# EAGLE design Domino Di (EAGLE 6.5.0)
Domino breakout Board
DATABASE: ./../Common/BOM/Domino_DB.txt; DRAWN: M.STEMPIN; REV: B
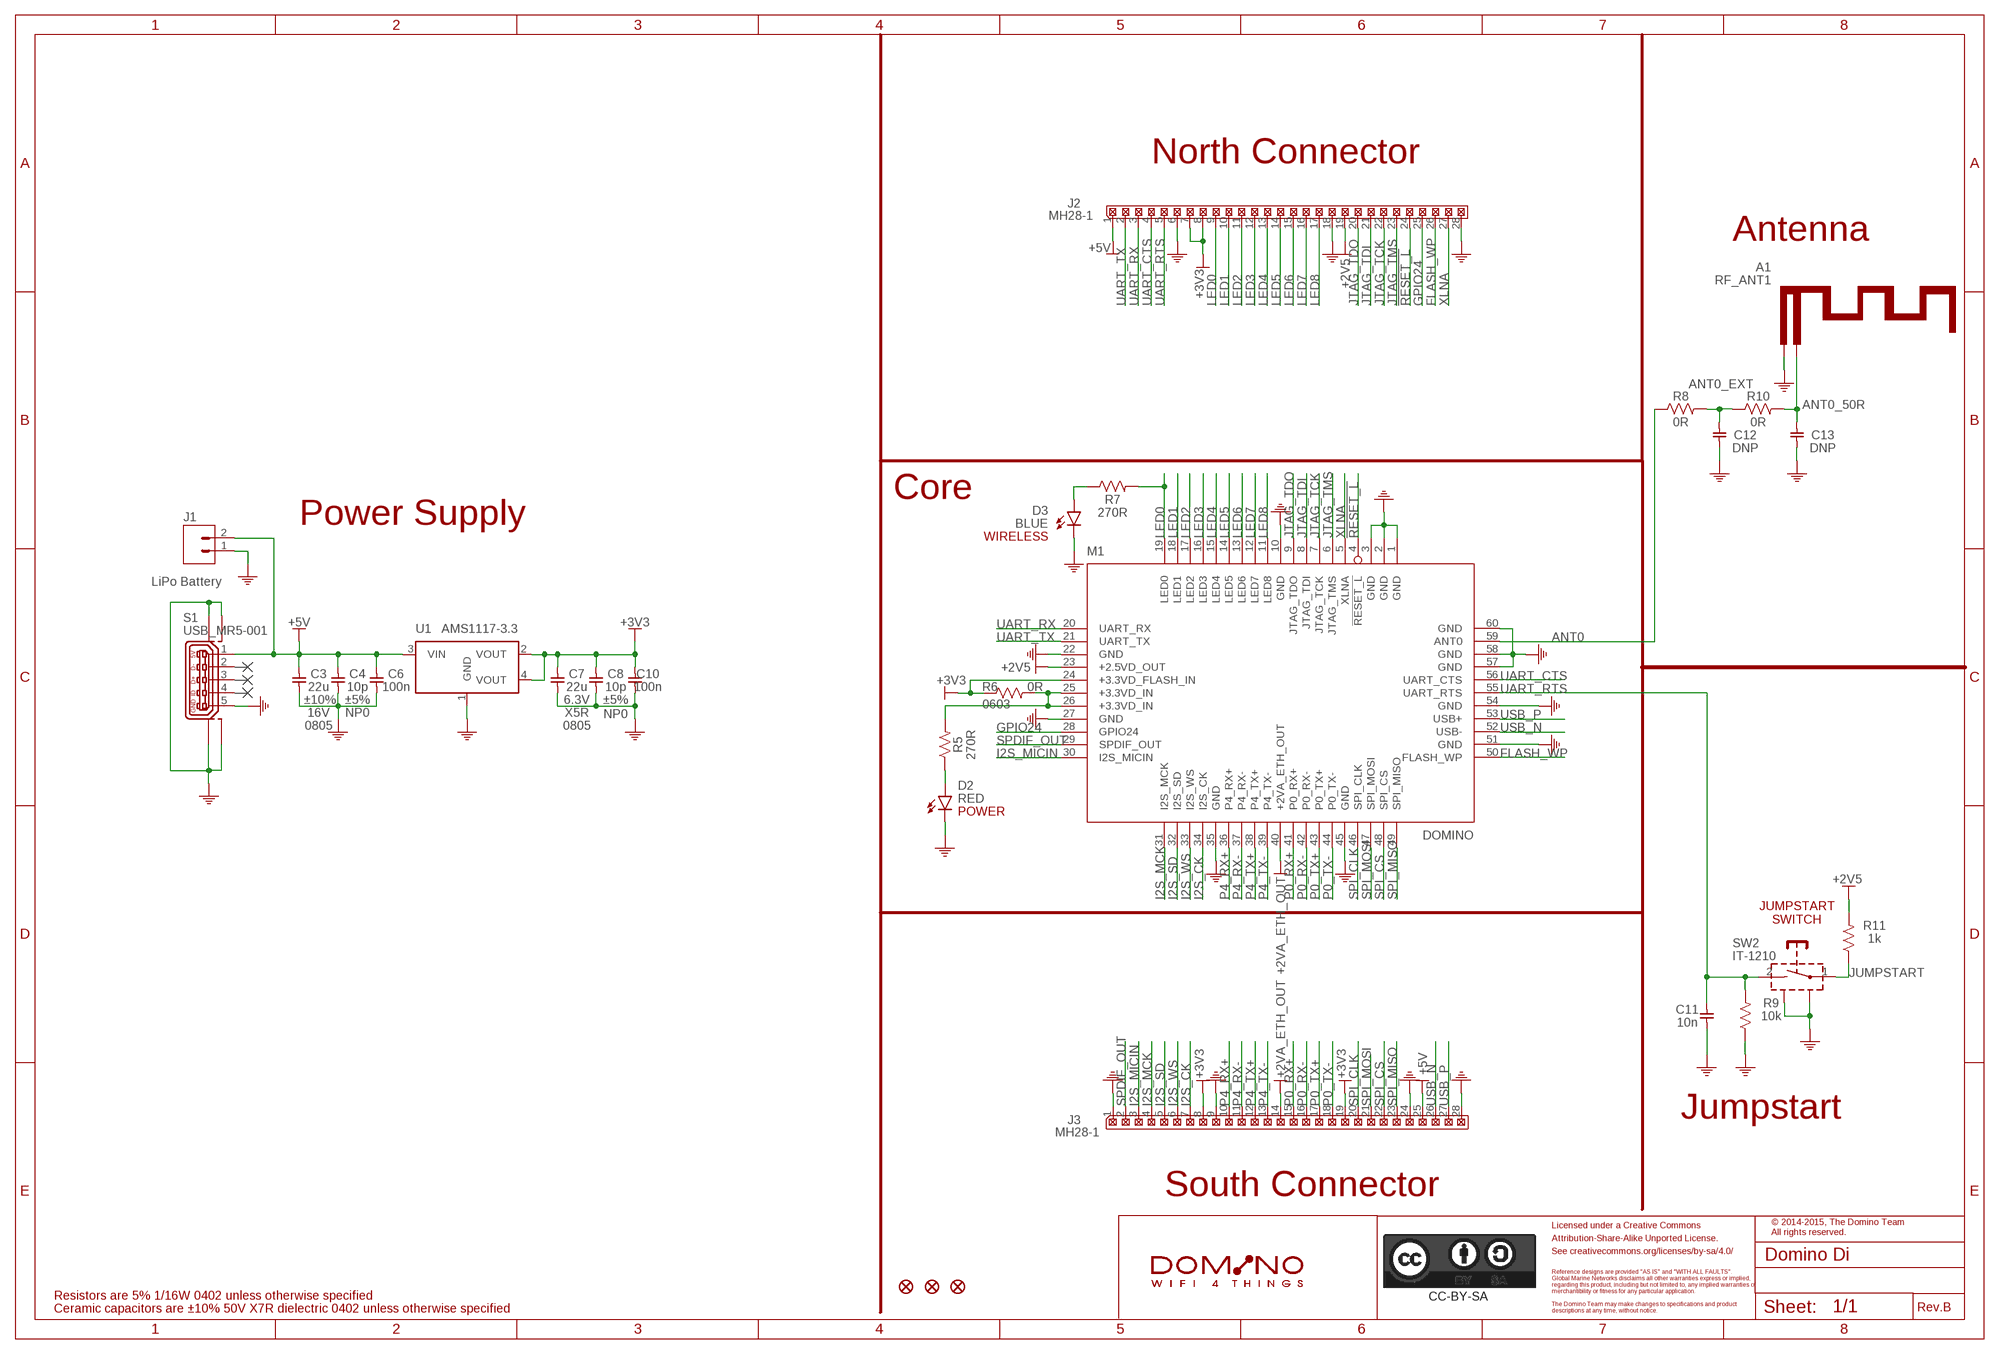
[diagram p0: schematic, sheet 1]
PORT1 (NC): BOM: EXCLUDE
PORT2 (NC): BOM: EXCLUDE
PORT3 (NC): BOM: EXCLUDE

## Parts
A1  RF_ANT1  [RF_ANT1]
C3  22u  CAP_0805  [C0805]
C4  10p  CAP_0402  [C0402]
C6  100n  CAP_0402  [C0402]
C7  22u  CAP_0805  [C0805]
C8  10p  CAP_0402  [C0402]
C10  100n  CAP_0402  [C0402]
C11  10n  CAP_0402  [C0402]
C12  DNP  CAP_0402  [C0402]
C13  DNP  CAP_0402  [C0402]
CC-BY-SA  CC-BY-SA_LOGO  [CC-BY-SA_LOGO]
D2  RED  LED_0402  [LED0402]
D3  BLUE  LED_0402  [LED0402]
F1  FIDUCIAL  [FIDUCIAL]
F2  FIDUCIAL  [FIDUCIAL]
F3  FIDUCIAL  [FIDUCIAL]
J1  LiPo Battery  S2B-PH-SM4-TB  [S2B-PH-SM4-TB]
J2  MH28-1  [MH28-1-0.1]
J3  MH28-1  [MH28-1-0.1]
M1  DOMINO  [DOMINO]
R5  270R  RES_0402  [R0402]
R6  0R  RES_0603  [R0603]
R7  270R  RES_0402  [R0402]
R8  0R  RES_0402  [R0402]
R9  10k  RES_0402  [R0402]
R10  0R  RES_0402  [R0402]
R11  1k  RES_0402  [R0402]
S1  USB_MR5-001  [USB-MR5-001]
SW2  IT-1210  [IT-1210]
U1  AMS1117-3.3  [SOT223]
W1  DOMINO_LOGO  [DOMINO_LOGO]

## Nets
!RESET_L: J2.24 M1.4(!RESET_L)
+2V5: J2.19 M1.23(+2.5VD_OUT) R11.2
+2VA_ETH_OUT [Ethernet]: J3.14 M1.40(+2VA_ETH_OUT)
+3.3VD_IN: M1.25(+3.3VD_IN) M1.26(+3.3VD_IN) R5.2 R6.2
+3V3: C7.1 C8.1 C10.1 J2.7 J2.8 J3.8 J3.19 M1.24(+3.3VD_FLASH_IN) R6.1 U1.2(VOUT) U1.4(VOUT)
+5V: C3.1 C4.1 C6.1 J1.2 J2.1 J3.25 S1.1 U1.3(VIN)
ANT0 [RF]: M1.59(ANT0) R8.1
ANT0_50R [RF]: A1.FEED C13.1 R10.2
ANT0_EXT [RF]: C12.1 R8.2 R10.1
BLUE_LED: D3.2(A) R7.1
FLASH_WP: J2.26 M1.50(FLASH_WP)
GND: A1.GND C3.2 C4.2 C6.2 C7.2 C8.2 C10.2 C11.2 C12.2 C13.2 D2.1(C) D3.1(C) J1.1 J2.6 J2.18 J2.28 J3.1 J3.9 J3.24 J3.28 M1.1(GND) M1.2(GND) M1.3(GND) M1.10(GND) M1.22(GND) M1.27(GND) M1.35(GND) M1.45(GND) M1.51(GND) M1.54(GND) M1.57(GND) M1.58(GND) M1.60(GND) R9.1 S1.5 S1.SH$1(M0) S1.SH$2(M1) S1.SH$3(M2) S1.SH$4(M3) SW2.SH$1 SW2.SH$2 U1.1(GND)
GPIO24: J2.25 M1.28(GPIO24)
I2S_CK: J3.7 M1.34(I2S_CK)
I2S_MCK: J3.4 M1.31(I2S_MCK)
I2S_MICIN: J3.3 M1.30(I2S_MICIN)
I2S_SD: J3.5 M1.32(I2S_SD)
I2S_WS: J3.6 M1.33(I2S_WS)
JTAG_TCK: J2.22 M1.7(JTAG_TCK)
JTAG_TDI: J2.21 M1.8(JTAG_TDI)
JTAG_TDO: J2.20 M1.9(JTAG_TDO)
JTAG_TMS: J2.23 M1.6(JTAG_TMS)
JUMPSTART: R11.1 SW2.1
LED0: J2.9 M1.19(LED0) R7.2
LED1: J2.10 M1.18(LED1)
LED2: J2.11 M1.17(LED2)
LED3: J2.12 M1.16(LED3)
LED4: J2.13 M1.15(LED4)
LED5: J2.14 M1.14(LED5)
LED6: J2.15 M1.13(LED6)
LED7: J2.16 M1.12(LED7)
LED8: J2.17 M1.11(LED8)
N$1: D2.2(A) R5.1
P0_RX+ [Ethernet]: J3.15 M1.41(P0_RX+)
P0_RX- [Ethernet]: J3.16 M1.42(P0_RX-)
P0_TX+ [Ethernet]: J3.17 M1.43(P0_TX+)
P0_TX- [Ethernet]: J3.18 M1.44(P0_TX-)
P4_RX+ [Ethernet]: J3.10 M1.36(P4_RX+)
P4_RX- [Ethernet]: J3.11 M1.37(P4_RX-)
P4_TX+ [Ethernet]: J3.12 M1.38(P4_TX+)
P4_TX- [Ethernet]: J3.13 M1.39(P4_TX-)
SPDIF_OUT: J3.2 M1.29(SPDIF_OUT)
SPI_CLK: J3.20 M1.46(SPI_CLK)
SPI_CS: J3.22 M1.48(SPI_CS)
SPI_MISO: J3.23 M1.49(SPI_MISO)
SPI_MOSI: J3.21 M1.47(SPI_MOSI)
UART_CTS: J2.4 M1.56(UART_CTS)
UART_RTS: C11.1 J2.5 M1.55(UART_RTS) R9.2 SW2.2
UART_RX: J2.3 M1.20(UART_RX)
UART_TX: J2.2 M1.21(UART_TX)
USB_N [USB]: J3.26 M1.52(USB-)
USB_P [USB]: J3.27 M1.53(USB+)
XLNA: J2.27 M1.5(XLNA)
Unconnected: S1.2 S1.3 S1.4

## Notes on the sheet
- North Connector
- Antenna
- Core
- Power Supply
- WIRELESS
- POWER
- JUMPSTART
  SWITCH
- Jumpstart
- South Connector
- Licensed under a Creative Commons
- © 2014-2015, The Domino Team
  All rights reserved.
- Attribution-Share-Alike Unported License.
- See creativecommons.org/licenses/by-sa/4.0/
- Reference designs are provided "AS IS" and "WITH ALL FAULTS".
- Global Marine Networks disclaims all other warranties express or implied,
- regarding this product, including but not limited to, any implied warranties of
- merchantibility or fitness for any particular application.
- Resistors are 5% 1/16W 0402 unless otherwise specified
- The Domino Team may make changes to specifications and product
- Ceramic capacitors are ±10% 50V X7R dielectric 0402 unless otherwise specified | descriptions at any time, without notice. | Rev.

## Library data of the parts
A1 = Domino:RF_ANT1: 2.4 GHz PCB WiFi Antenna; BOM: EXCLUDE; PARTNO: WIFI_ANT-2.4GHz
C3 = Domino:CAP_: Capacitor; PARTNO: C0805_22u_X5R_20%_CER_6V3; SIZE: 0805; TC: X5R; TOL: ±10%; TYPE: CER; VOLT: 16V
C4 C8 = Domino:CAP_: Capacitor; PARTNO: C0402_10p_NP0_5%_CER_50V; SIZE: 0402; TC: NP0; TOL: ±5%; TYPE: CER; VOLT: 50V
C6 C10 = Domino:CAP_: Capacitor; PARTNO: C0402_100n_X7R_10%_CER_50V; SIZE: 0402; TC: X7R; TOL: ±10%; TYPE: CER; VOLT: 50V
C7 = Domino:CAP_: Capacitor; PARTNO: C0805_22u_X5R_20%_CER_6V3; SIZE: 0805; TC: X5R; TOL: ±20%; TYPE: CER; VOLT: 6.3V
C11 = Domino:CAP_: Capacitor; PARTNO: C0402_10n_X7R_10%_CER_50V; SIZE: 0402; TC: X7R; TOL: ±10%; TYPE: CER; VOLT: 50V
C12 C13 = Domino:CAP_: Capacitor; DNP: T; PARTNO: C0402_DNP; SIZE: 0402
CC-BY-SA = Domino:CC-BY-SA_LOGO: Attribution-Share-Alike Unported License See creativecommons.org/licenses/by-sa/3.0/ for details.; BOM: EXCLUDE
D2 = Domino:LED_: LED; PARTNO: LED0402-RED
D3 = Domino:LED_: LED; PARTNO: LED0402-BLUE
F1-F3 = Domino:FIDUCIAL: Fiducial Mark; BOM: EXCLUDE
J1 = Domino:S*B-PH-?-TB: JST PH Connector 2.0mm pithc/Disconnectable Crimp style connectors; PARTNO: S2B-PH-SM4-TB
J2 J3 = Domino:MH28-1: 28x1 Pin Male Header; PARTNO: MH28-1-0.1
M1 = Domino:DOMINO: GL-Connect Domino WiFi Module; PARTNO: DOMINO-CORE
R5 R7 = Domino:RES_: Resistor; PARTNO: R0402_270R_5%_62.5mW; RATE: 62.5mW; SIZE: 0402; TOL: 5%
R6 = Domino:RES_: Resistor; PARTNO: R0603_0R_5%_125mW; RATE: 125mW; SIZE: 0603; TOL: 5%
R8 R10 = Domino:RES_: Resistor; PARTNO: R0402_0R_5%_62.5mW; RATE: 62.5mW; SIZE: 0402; TOL: 5%
R9 = Domino:RES_: Resistor; PARTNO: R0402_10k_5%_62.5mW; RATE: 62.5mW; SIZE: 0402; TOL: 5%
R11 = Domino:RES_: Resistor; PARTNO: R0402_1k_5%_62.5mW; RATE: 62.5mW; SIZE: 0402; TOL: 5%
S1 = Domino:USB_MR5-001: Micro USB Type B Receptacle, 4 Shield Pins SMT; PARTNO: USB MR5-001
SW2 = Domino:IT-1210: Tact Switch SPST, 2 Contacts, 2 Shield Pins; PARTNO: IT-1210
U1 = Domino:AMS1117-: 1-A, Positive Fixed Voltage, Low-Dropout Regulator; PARTNO: AMS1117-3.3
W1 = Domino:DOMINO_LOGO: Domino Logo; BOM: EXCLUDE

## Net classes
1 USB: width 0.368 mm, clearance 0.152 mm to class 0, clearance 0.152 mm
2 RF: width 0.66 mm, clearance 0.152 mm
3 Ethernet: width 0.254 mm, clearance 0.152 mm to class 0, clearance 0.152 mm to class 1, clearance 0.152 mm to class 2, clearance 0.152 mm

## Board
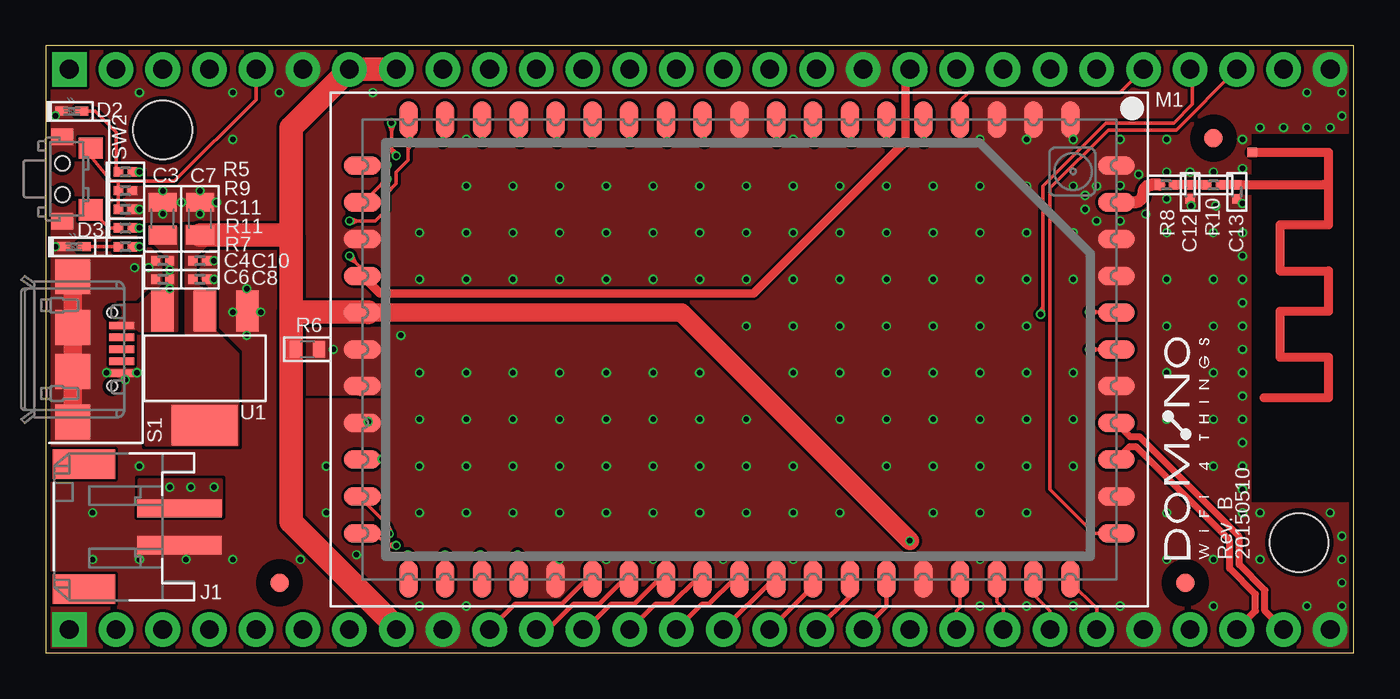
[diagram p1: board, top side]
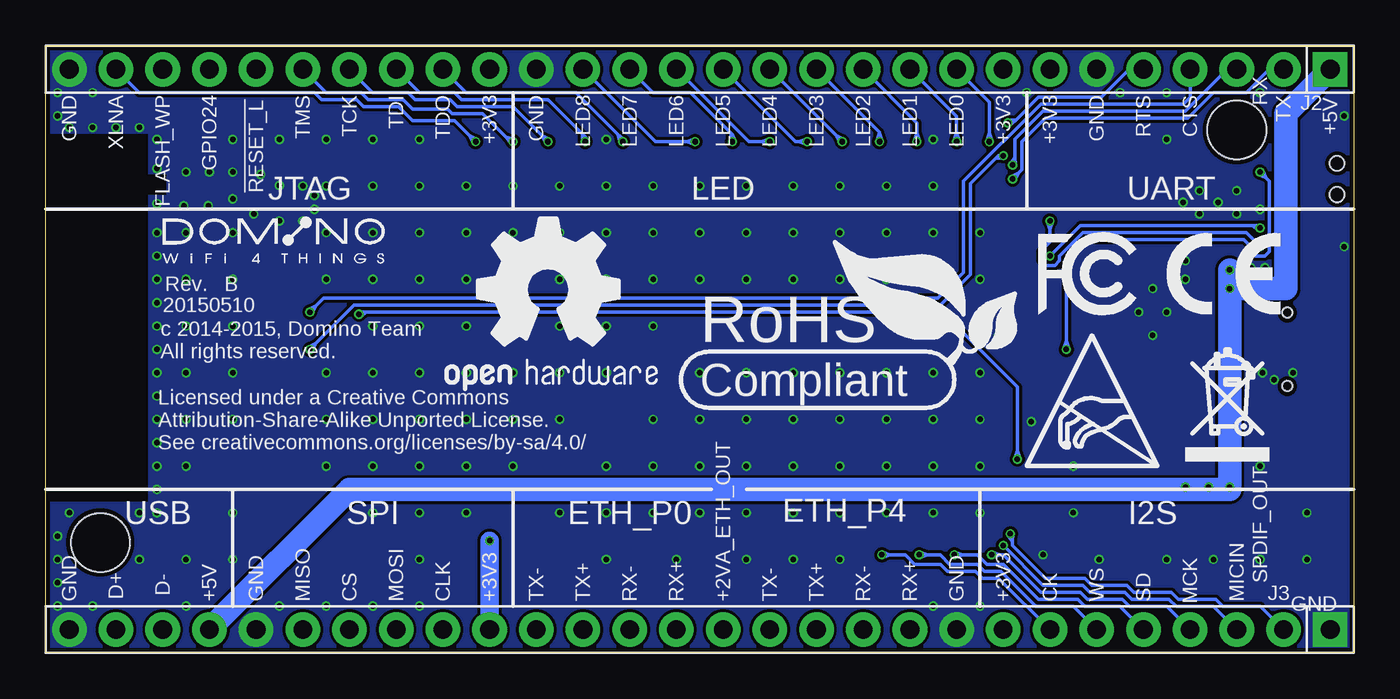
[diagram p2: board, bottom side, seen from below]

Size 71.12 x 33.02 mm. Coordinates in mm from the lower left corner, seen from the top.
Outline: 0,0 71.12,0 71.12,33.02 0,33.02 0,0
Copper layers (1*16): Top 0.043mm / dielectric 1mm / Bottom 0.043mm
Design rules "Domino *": minimum track width 0.1mm, minimum drill 0.3mm, track to track 6mil, track to pad 6mil, pad to pad 6mil, via to via 6mil, smd to smd 0mil, copper to edge 0.25mm, drill to drill 0.35mm, minimum pad ring 0.085mm, minimum via ring 0.1mm, stop-mask expansion 0mil, vias tented up to drill 0.45mm, thermal gap 0.2mm
Holes 3.2 mm at 68.16,6 6.35,28.45

### Footprints (pad centres in the part's own frame; a part is rotated, then mirrored left to right if it is on the bottom)
RF_ANT1 = smd 0.5 x 0.5: FEED 1.75,-0.44; GND 0,0.5
C0805 = smd 1.016 x 1.524: 1 -0.889,0; 2 0.889,0
C0402 = smd 0.508 x 0.508: 1 -0.381,0; 2 0.381,0
LED0402 = smd 0.7 x 0.5: 1 -0.55,0; 2 0.55,0
FIDUCIAL = smd 1.016 x 1.016: 1 0,0
S2B-PH-SM4-TB = smd 1 x 4.6: 1 -1,-3.7; 2 1,-3.7 | smd 1.6 x 3.4: NC1 -3.4,1.5; NC2 3.4,1.5
MH28-1-0.1 = drill 1.016 pad 1.88 square: 1 0,0 | drill 1.016 pad 1.88: 2 2.54,0; 3 5.08,0; 4 7.62,0; 5 10.16,0; 6 12.7,0; 7 15.24,0; 8 17.78,0; 9 20.32,0; 10 22.86,0; 11 25.4,0; 12 27.94,0; 13 30.48,0; 14 33.02,0; 15 35.56,0; 16 38.1,0; 17 40.64,0; 18 43.18,0; 19 45.72,0; 20 48.26,0; 21 50.8,0; 22 53.34,0; 23 55.88,0; 24 58.42,0; 25 60.96,0; 26 63.5,0; 27 66.04,0; 28 68.58,0
DOMINO = smd 2 x 1: 1 -12.5,18; 2 -12.5,16; 3 -12.5,14; 4 -12.5,12; 5 -12.5,10; 6 -12.5,8; 7 -12.5,6; 8 -12.5,4; 9 -12.5,2; 10 -12.5,0; 11 -12.5,-2; 12 -12.5,-4; 13 -12.5,-6; 14 -12.5,-8; 15 -12.5,-10; 16 -12.5,-12; 17 -12.5,-14; 18 -12.5,-16; 19 -12.5,-18; 31 12.5,-18; 32 12.5,-16; 33 12.5,-14; 34 12.5,-12; 35 12.5,-10; 36 12.5,-8; 37 12.5,-6; 38 12.5,-4; 39 12.5,-2; 40 12.5,0; 41 12.5,2; 42 12.5,4; 43 12.5,6; 44 12.5,8; 45 12.5,10; 46 12.5,12; 47 12.5,14; 48 12.5,16; 49 12.5,18 | smd 1 x 2: 20 -10,-20.5; 21 -8,-20.5; 22 -6,-20.5; 23 -4,-20.5; 24 -2,-20.5; 25 0,-20.5; 26 2,-20.5; 27 4,-20.5; 28 6,-20.5; 29 8,-20.5; 30 10,-20.5; 50 10,20.5; 51 8,20.5; 52 6,20.5; 53 4,20.5; 54 2,20.5; 55 0,20.5; 56 -2,20.5; 57 -4,20.5; 58 -6,20.5; 59 -8,20.5; 60 -10,20.5
R0402 = smd 0.508 x 0.508: 1 -0.381,0; 2 0.381,0
R0603 = smd 0.635 x 0.889: 1 -0.635,0; 2 0.635,0
USB-MR5-001 = smd 0.4 x 1.35: 1 -1.3,2.675; 2 -0.65,2.675; 3 0,2.675; 4 0.65,2.675; 5 1.3,2.675 | smd 1.9 x 1.9: SH$1 -3.95,0; SH$2 -1.2,0; SH$3 1.2,0; SH$4 3.95,0 | hole 0.55: -2,2.15; 2,2.15
IT-1210 = smd 1.15 x 1.3: 1 -1.675,-1.55; 2 1.675,-1.55 | smd 0.9 x 1.2: SH$1 -2.3,0; SH$2 2.3,0 | hole 0.8: -0.85,0; 0.85,0
SOT223 = smd 1.219 x 2.235: 1 -2.311,-3.099; 2 0,-3.099; 3 2.311,-3.099 | smd 3.6 x 2.2: 4 0,3.099

### Placement (x,y rotation side)
A1  65.1,27.23 270 top
C3  6.35,23.62 90 top
C4  6.35,21.34 180 top
C6  6.35,20.32 180 top
C7  8.38,23.62 90 top
C8  8.38,20.32 0 top
C10  8.38,21.34 0 top
C11  4.32,24.13 0 top
C12  62.23,25.08 270 top
C13  64.77,25.08 270 top
CC-BY-SA  10.16,-49.53 0 top  (outside the outline)
D2  1.4,29.46 0 top
D3  1.52,22.1 0 top
DRILEGEND  [DRILEGEND]  96.77,61.21 0 top  (outside the outline)
F1  12.7,3.81 0 top
F2  61.98,3.81 0 top
F3  63.5,28 0 top
J1  3.56,6.86 90 top
J2  1.27,31.75 180 bottom
J3  1.27,1.27 180 bottom
M1  37.72,16.51 270 top
R5  4.32,26.16 0 top
R6  14.22,16.51 0 top
R7  4.32,22.1 0 top
R8  60.96,25.46 0 top
R9  4.32,25.15 180 top
R10  63.5,25.46 0 top
R11  4.32,23.11 0 top
S1  1.45,16.51 270 top
SW2  0.89,25.78 90 top
U1  8.64,15.49 180 top
U$6  [DOMINO_LOGO_SMALL]  62.23,5.08 90 top
U$8  [DOMINO_LOGO_SMALL]  64.77,22.23 0 bottom
U$28  [A5L-LOC]  -40.64,-60.96 0 top  (outside the outline)
U$36  [ESD_LOGO]  17.78,10.16 0 bottom
U$38  [OPEN_HARDWARE_LOGO]  43.81,19.68 0 bottom
U$39  [RECYCLE_BIN_LOGO]  9.14,10.41 0 bottom
U$40  [ROHS_LOGO]  35.56,13.97 0 bottom
U$41  [CE_LOGO_SMALL]  10.16,18.41 0 bottom
U$42  [FCC_LOGO_SMALL]  17.14,18.41 0 bottom
W1  -33.02,-46.99 0 top  (outside the outline)

### Tracks (layer width: path | path; a pad name or v marks a point on that pad's centre or on a via)
!RESET_L
  Top 0.203: M1.4 49.72,30.03 50.16,30.48 58.42,30.48 J2.24
+2V5  (via drill 0.3)
  Top 0.203: M1.23 17.22,20.88 16.83,21.27 | 16.83,21.27 v16.51,21.59 | v5.08,23.11 R11.2 | 16.83,21.27 16.64,21.65 v16.51,21.59 | 16.83,21.27 16.45,21.46 v16.51,21.59
  Top 0.457: J2.19 46.74,31.5 46.74,27.81 38.48,19.56 18.17,19.56 M1.23
  Bottom 0.203: v5.08,23.11 5.21,23.24 5.51,23.24 | 5.51,23.24 14.86,23.24 v16.51,21.59 | 5.51,23.24 5.09,23.26 v5.08,23.11 | 5.51,23.24 5.17,22.99 v5.08,23.11
+2VA_ETH_OUT
  Top 0.254: M1.40 37.41,4.01 36.07,2.67 35.69,2.67 J3.14
+3.3VD_IN  (via drill 0.3)
  Top 0.203: R5.2 v5.08,26.16
  Top 1.016: M1.26 arc-45 17.14,14.48
  Bottom 0.203: 4.76,25.84 4.57,25.65 4.57,21.84 4.83,21.59 5.33,21.59 5.59,21.84 5.59,22.1 5.97,22.48 14.61,22.48 15.62,21.46 15.62,16.96 | 4.76,25.84 v5.08,26.16 | 15.62,16.96 v15.62,16.51 | 15.62,16.96 15.48,16.56 v15.62,16.51 | 15.62,16.96 15.76,16.56 v15.62,16.51 | 4.76,25.84 5.14,26.03 v5.08,26.16 | 4.76,25.84 4.95,26.23 v5.08,26.16
  pour Top (no thermals): 13.97,17.65 18.16,17.65 18.16,14.1 13.97,14.1
+3V3  (via drill 0.3 pad 0.03)
  Top 0.203: R6.1 13.34,16.51 13.34,18.29
  Top 1.016: M1.24 17.53,18.51 34.58,18.51 v46.99,6.1 | M1.24 | 16.51,31.62 J2.7 | M1.24 16.77,18.51
  Top 1.27: J2.8 J2.7 13.34,28.57 13.34,22.73 | J3.8 19.05,1.52 18.92,1.52 13.34,7.11 13.34,18.29 13.34,18.54 | C7.1 13.34,22.73 | 13.34,18.54 17.53,18.54 17.53,18.51 | 13.34,22.73 13.34,18.54
  Bottom 1.016: J3.19 v46.99,6.1
  pour Top (no thermals): 7.62,23.24 9.02,23.11 9.02,22.35 8.89,22.35 8.13,21.59 8.13,20.19 8.76,19.56 9.14,19.56 9.14,17.53 10.41,16.26 10.41,11.3 5.46,11.3 5.46,17.14 7.62,17.14
+5V  (via drill 0.3)
  Bottom 1.27: J2.1 3.68,29.34 3.68,19.81 v6.73,19.81 | J3.25 54.61,8.89 6.73,8.89 v6.73,9.02 v6.73,19.81 | v6.73,19.81 v6.73,20.83
  other vias: 9.14,9.02 7.87,9.02
  pour Top (no thermals): 5.71,23.11 7.11,23.11 7.11,17.53 5.08,17.53 4.95,17.65 3.56,17.65 3.56,18.92 5.08,18.92 5.71,19.56 6.22,19.56 6.6,19.94 6.6,21.59 5.84,22.35 5.71,22.35
  pour Top (no thermals): 5.08,7.49 9.53,7.49 9.53,9.4 5.08,9.4 5.08,7.62
ANT0
  Top 0.66: 57.78,24.51 M1.59 59.18,24.51 arc90 59.69,25.02 arc-90 60.13,25.46 R8.1
ANT0_50R
  Top 0.508: R10.2 C13.1 64.64,25.46 A1.FEED
ANT0_EXT
  Top 0.508: R8.2 C12.1 R10.1
BLUE_LED
  Top 0.203: D3.2 R7.1
FLASH_WP
  Top 0.203: M1.50 56.99,6.51 54.61,8.89 54.61,25.27 57.78,28.45 61.47,28.45 J2.26
GND  (via drill 0.3, 0.3 pad 0.03)
  Top 1.016: S1.SH$3 S1.SH$1 1.56,20.57 | S1.SH$3 S1.SH$2 | S1.SH$3 S1.SH$4
  other vias: 25.4,25.4 27.94,25.4 30.48,25.4 45.72,25.4 57.15,25.4 59.44,26.04 60.96,24.7 63.5,22.86 50.8,22.86 45.72,22.86 27.94,20.32 30.48,20.32 33.02,20.32 35.56,20.32 38.1,20.32 40.64,20.32 45.72,20.32 50.8,20.32 22.86,15.24 20.32,12.7 27.94,15.24 30.48,15.24 33.02,15.24 35.56,15.24 43.18,15.24 45.72,15.24 50.8,15.24 60.96,12.7 50.8,12.7 45.72,12.7 38.1,12.7 35.56,12.7 33.02,12.7 27.94,12.7 25.4,12.7 27.94,10.16 30.48,10.16 33.02,10.16 35.56,10.16 38.1,10.16 40.64,10.16 63.5,10.16 55.88,2.54 57.15,23.5 56.52,24.13 56.52,24.89 58.42,25.43 58.42,23.5 60.96,26.16 59.82,23.88 62.23,26.16 38.1,22.86 33.02,22.86 30.48,22.86 27.94,22.86 25.4,22.86 43.18,20.32 25.4,10.16 22.86,20.32 63.5,5.08 58.42,2.54 22.86,10.16 22.86,25.4 33.02,25.4 35.56,22.86 35.56,25.4 38.1,25.4 40.64,25.4 40.64,22.86 43.18,22.86 27.94,5.08 68.58,30.48 60.96,27.94 58.42,27.94 53.34,27.94 50.8,27.94 50.8,25.4 53.34,25.4 53.34,22.86 53.34,20.32 53.34,15.24 53.34,12.7 53.34,10.16 50.8,10.16 45.72,10.16 43.18,12.7 40.64,15.24 60.96,7.62 60.96,5.08 63.5,2.54 30.48,12.7 17.78,30.48 20.32,20.32 20.32,15.24 43.18,25.4 40.64,27.94 22.86,27.94 55.88,22.86 55.88,20.32 55.88,15.24 55.88,12.7 55.88,10.16 55.88,25.4 68.58,2.54 30.48,5.08 33.02,5.08 36.83,5.08 40.64,5.08 50.8,5.08 53.34,2.54 50.8,2.54 48.26,25.4 48.26,22.86 48.26,20.32 48.26,15.24 48.26,12.7 48.26,10.16 20.32,22.86 20.32,2.54 22.86,2.54 55.88,27.94 66.04,5.08 0.51,29.21 0.51,22.1 12.7,30.48 10.16,30.48 63.5,12.7 63.5,15.24 60.96,15.24 60.96,17.78 63.5,17.78 63.5,20.32 60.96,20.32 60.96,22.86 62.29,24.32 63.63,24.32 65.09,24.45 63.5,26.16 65.09,26.35 65.09,20.32 65.09,21.59 65.09,22.86 65.09,19.05 65.09,17.78 65.09,16.51 65.09,15.24 65.09,13.97 65.09,12.7 65.09,11.43 65.09,10.16 65.09,8.89 65.09,7.62 66.04,7.62 69.85,7.62 70.48,6.35 70.48,5.08 70.48,3.81 70.48,2.54 65.09,27.94 66.04,28.57 67.31,28.57 68.58,28.57 69.85,28.57 70.48,29.21 70.48,30.48 25.4,15.24 22.86,12.7 20.32,10.16 40.64,17.78 43.18,17.78 45.72,17.78 48.26,17.78 50.8,17.78 53.34,17.78 38.1,17.78 20.32,7.62 22.86,7.62 25.4,7.62 27.94,7.62 30.48,7.62 33.02,7.62 35.56,7.62 38.1,7.62 40.64,7.62 43.18,7.62 48.26,7.62 50.8,7.62 53.34,7.62 25.4,20.32 22.86,22.86 13.84,5.08 16.89,5.33 17.53,12.57 19.3,17.27 4.95,15.24 4.32,14.86 2.54,7.62 2.54,5.08 5.08,5.08 7.62,5.08 10.16,5.08 15.24,7.62 5.08,24.13 10.16,27.94 15.24,10.16 5.08,30.48 5.08,10.16 6.35,25.15 8.38,25.15 9.27,24.51 7.37,24.51 6.35,23.88 8.38,23.88 9.14,21.34 9.14,20.32 10.92,19.81 11.68,18.54 10.16,18.54 10.92,17.27 3.3,15.24 5.59,20.95 4.83,20.95
  pour Top (rank 3, no thermals): 0,33 71.62,33 71.62,0 0,0 0,12.7 0,20.32
  pour Bottom (no thermals): 0,33 71.62,33 71.62,0 0,0 0,12.7 0,20.32
GPIO24  (via drill 0.3 pad 0.03)
  Top 0.203: v18.29,10.54 17.84,10.54 | 17.84,10.54 17.25,10.54 M1.28 | J2.25 62.36,31.62 62.36,29.84 61.34,28.83 57.66,28.83 54.23,25.4 54.23,18.85 | 54.23,18.85 54.23,18.54 v54.1,18.41 | 17.84,10.54 18.24,10.4 v18.29,10.54 | 17.84,10.54 18.24,10.68 v18.29,10.54 | 54.23,18.85 53.98,18.5 v54.1,18.41 | 54.23,18.85 54.25,18.42 v54.1,18.41
  Bottom 0.203: 53.67,18.54 22.35,18.54 18.29,14.48 18.29,10.99 | 53.67,18.54 53.98,18.54 v54.1,18.41 | v18.29,10.54 18.29,10.99 | 18.29,10.99 18.15,10.59 v18.29,10.54 | 18.29,10.99 18.43,10.59 v18.29,10.54 | 53.67,18.54 54.02,18.29 v54.1,18.41 | 53.67,18.54 54.09,18.56 v54.1,18.41
I2S_CK  (via drill 0.3 pad 0.03)
  Top 0.254: M1.34 25.72,4.89 | 25.72,4.89 25.72,5.27 v25.65,5.33 | 25.72,4.89 25.78,5.32 v25.65,5.33 | 25.72,4.89 25.54,5.28 v25.65,5.33
  Bottom 0.203: v25.65,5.33 25.2,5.33 | 25.2,5.33 24.38,5.33 23.88,4.83 22.48,4.83 22.1,4.45 20.57,4.45 20.19,4.06 19.3,4.06 J3.7 | 25.2,5.33 25.61,5.19 v25.65,5.33 | 25.2,5.33 25.61,5.47 v25.65,5.33
I2S_MCK  (via drill 0.3 pad 0.03)
  Top 0.254: M1.31 19.72,4.88 | 19.72,4.88 19.72,5.3 v19.68,5.33 | 19.72,4.88 19.81,5.31 v19.68,5.33 | 19.72,4.88 19.57,5.29 v19.68,5.33
  Bottom 0.203: v19.68,5.33 19.23,5.33 | 19.23,5.33 19.05,5.33 17.02,3.3 14.86,3.3 14.48,2.92 12.57,2.92 12.19,2.54 10.16,2.54 J3.4 | 19.23,5.33 19.64,5.19 v19.68,5.33 | 19.23,5.33 19.64,5.47 v19.68,5.33
I2S_MICIN  (via drill 0.3 pad 0.03)
  Top 0.203: M1.30 17.87,6.51 18.54,5.84 18.6,5.84 | 18.6,5.84 v19.05,5.84 | 18.6,5.84 19,5.7 v19.05,5.84 | 18.6,5.84 19,5.98 v19.05,5.84
  Bottom 0.203: v19.05,5.84 16.89,3.68 14.73,3.68 14.35,3.3 12.45,3.3 12.06,2.92 10.03,2.92 9.65,2.54 7.62,2.54 J3.3
I2S_SD  (via drill 0.3 pad 0.03)
  Top 0.254: M1.32 21.72,4.88 | 21.72,4.88 v21.72,5.33 | 21.72,4.88 21.84,5.3 v21.72,5.33 | 21.72,4.88 21.6,5.3 v21.72,5.33
  Bottom 0.203: v21.72,5.33 21.27,5.33 | 21.27,5.33 20.45,5.33 19.94,4.83 19.05,4.83 17.14,2.92 14.99,2.92 14.61,2.54 12.7,2.54 J3.5 | 21.27,5.33 21.67,5.19 v21.72,5.33 | 21.27,5.33 21.67,5.47 v21.72,5.33
I2S_WS  (via drill 0.3 pad 0.03)
  Top 0.254: M1.33 23.72,4.89 | 23.72,4.89 23.72,5.24 v23.62,5.33 | 23.72,4.89 23.75,5.33 v23.62,5.33 | 23.72,4.89 23.51,5.28 v23.62,5.33
  Bottom 0.203: v23.62,5.33 23.17,5.33 | 23.17,5.33 22.48,5.33 21.97,4.83 20.45,4.83 20.07,4.45 19.18,4.45 17.27,2.54 15.24,2.54 J3.6 | 23.17,5.33 23.57,5.19 v23.62,5.33 | 23.17,5.33 23.57,5.47 v23.62,5.33
JTAG_TCK  (via drill 0.3 pad 0.03)
  Top 0.203: M1.7 43.72,28.25 | 43.72,28.25 43.72,27.91 v43.81,27.81 | 43.72,28.25 43.67,27.83 v43.81,27.81 | 43.72,28.25 43.94,27.89 v43.81,27.81
  Bottom 0.203: v43.81,27.81 44.13,28.13 | 44.13,28.13 45.72,29.72 48.77,29.72 49.15,30.1 51.05,30.1 51.44,30.48 53.34,30.48 J2.22 | 44.13,28.13 43.75,27.95 v43.81,27.81 | 44.13,28.13 43.95,27.75 v43.81,27.81
JTAG_TDI  (via drill 0.3 pad 0.03)
  Top 0.203: M1.8 41.72,28.26 | 41.72,28.26 41.72,27.88 v41.78,27.81 | 41.72,28.26 41.64,27.84 v41.78,27.81 | 41.72,28.26 41.91,27.88 v41.78,27.81
  Bottom 0.203: v41.78,27.81 41.78,28.07 41.95,28.23 | 41.95,28.23 43.81,30.1 48.51,30.1 48.9,30.48 50.8,30.48 J2.21 | 41.95,28.23 41.67,27.91 v41.78,27.81 | 41.95,28.23 41.93,27.81 v41.78,27.81
JTAG_TDO  (via drill 0.3 pad 0.03)
  Top 0.203: M1.9 39.72,28.26 | 39.72,28.26 39.72,27.84 v39.75,27.81 | 39.72,28.26 39.61,27.85 v39.75,27.81 | 39.72,28.26 39.89,27.87 v39.75,27.81
  Bottom 0.203: J2.20 48.26,30.48 42.29,30.48 40,28.19 | v39.75,27.81 39.75,27.94 40,28.19 | 40,28.19 39.66,27.93 v39.75,27.81 | 40,28.19 39.9,27.78 v39.75,27.81
JTAG_TMS  (via drill 0.3 pad 0.03)
  Top 0.203: M1.6 45.72,28.26 | 45.72,28.26 v45.72,27.81 | 45.72,28.26 45.58,27.86 v45.72,27.81 | 45.72,28.26 45.86,27.86 v45.72,27.81
  Bottom 0.203: v45.72,27.81 45.85,27.81 46.09,28.06 | 46.09,28.06 47.37,29.34 49.02,29.34 49.28,29.59 51.18,29.59 51.69,30.1 53.59,30.1 53.98,30.48 55.88,30.48 J2.23 | 46.09,28.06 45.68,27.96 v45.72,27.81 | 46.09,28.06 45.84,27.72 v45.72,27.81
JUMPSTART
  Top 0.203: 2.41,24.13 SW2.1 3.43,23.11 R11.1
LED0  (via drill 0.3, 0.3 pad 0.03)
  Top 0.203: v19.81,27.81 19.81,28.26 | 19.81,28.26 19.81,28.92 M1.19 | v5.08,22.1 R7.2 | v16.51,23.5 16.96,23.5 | 16.96,23.5 17.91,23.5 18.54,24.13 18.54,25.02 19.05,25.53 19.05,26.16 19.68,26.8 19.68,27.38 | 19.68,27.38 19.68,27.69 v19.81,27.81 | 19.81,28.26 19.67,27.86 v19.81,27.81 | 19.81,28.26 19.95,27.86 v19.81,27.81 | 19.68,27.38 19.93,27.73 v19.81,27.81 | 19.68,27.38 19.66,27.81 v19.81,27.81 | 16.96,23.5 16.56,23.64 v16.51,23.5 | 16.96,23.5 16.56,23.36 v16.51,23.5
  Bottom 0.203: v19.81,27.81 19.81,28.26 | 19.81,28.26 19.81,29.97 J2.9 | 16.51,23.05 16.51,22.35 17.02,21.84 17.02,21.34 16.76,21.08 16.26,21.08 16,21.34 16,21.59 14.73,22.86 5.84,22.86 v5.08,22.1 | 16.51,23.05 v16.51,23.5 | 19.81,28.26 19.67,27.86 v19.81,27.81 | 19.81,28.26 19.95,27.86 v19.81,27.81 | 16.51,23.05 16.65,23.45 v16.51,23.5 | 16.51,23.05 16.37,23.45 v16.51,23.5
LED1  (via drill 0.3 pad 0.03)
  Top 0.203: M1.18 21.72,28.24 | 21.72,28.24 21.72,27.94 v21.59,27.81 | 21.72,28.24 21.47,27.9 v21.59,27.81 | 21.72,28.24 21.74,27.82 v21.59,27.81
  Bottom 0.203: v21.59,27.81 21.59,28.26 | 21.59,28.26 21.59,29.21 J2.10 | 21.59,28.26 21.45,27.86 v21.59,27.81 | 21.59,28.26 21.73,27.86 v21.59,27.81
LED2  (via drill 0.3 pad 0.03)
  Top 0.203: M1.17 23.72,28.26 | 23.72,28.26 23.72,27.84 v23.75,27.81 | 23.72,28.26 23.61,27.85 v23.75,27.81 | 23.72,28.26 23.89,27.87 v23.75,27.81
  Bottom 0.203: J2.11 23.75,28.83 23.75,28.26 | 23.75,28.26 v23.75,27.81 | 23.75,28.26 23.61,27.86 v23.75,27.81 | 23.75,28.26 23.89,27.86 v23.75,27.81
LED3  (via drill 0.3 pad 0.03)
  Top 0.203: M1.16 25.72,28.26 | 25.72,28.26 25.72,27.88 v25.78,27.81 | 25.72,28.26 25.64,27.84 v25.78,27.81 | 25.72,28.26 25.91,27.88 v25.78,27.81
  Bottom 0.203: v25.78,27.81 25.78,28.26 | 25.78,28.26 25.78,28.32 J2.12 | 25.78,28.26 25.64,27.86 v25.78,27.81 | 25.78,28.26 25.92,27.86 v25.78,27.81
LED4  (via drill 0.3 pad 0.03)
  Top 0.203: M1.15 27.72,28.25 | 27.72,28.25 27.72,27.91 v27.81,27.81 | 27.72,28.25 27.67,27.83 v27.81,27.81 | 27.72,28.25 27.94,27.89 v27.81,27.81
  Bottom 0.203: v27.81,27.81 28.13,28.13 | 28.13,28.13 J2.13 | 28.13,28.13 27.75,27.95 v27.81,27.81 | 28.13,28.13 27.95,27.75 v27.81,27.81
LED5  (via drill 0.3 pad 0.03)
  Top 0.203: M1.14 29.72,28.26 | 29.72,28.26 v29.72,27.81 | 29.72,28.26 29.58,27.86 v29.72,27.81 | 29.72,28.26 29.86,27.86 v29.72,27.81
  Bottom 0.203: J2.14 30.35,27.81 30.17,27.81 | v29.72,27.81 30.17,27.81 | 30.17,27.81 29.77,27.95 v29.72,27.81 | 30.17,27.81 29.77,27.67 v29.72,27.81
LED6  (via drill 0.3 pad 0.03)
  Top 0.203: M1.13 31.72,28.26 | 31.72,28.26 31.72,27.84 v31.75,27.81 | 31.72,28.26 31.61,27.85 v31.75,27.81 | 31.72,28.26 31.89,27.87 v31.75,27.81
  Bottom 0.203: J2.15 32.89,27.81 32.2,27.81 | 32.2,27.81 v31.75,27.81 | 32.2,27.81 31.8,27.95 v31.75,27.81 | 32.2,27.81 31.8,27.67 v31.75,27.81
LED7  (via drill 0.3 pad 0.03)
  Top 0.203: M1.12 33.72,28.26 | 33.72,28.26 33.72,27.88 v33.78,27.81 | 33.72,28.26 33.64,27.84 v33.78,27.81 | 33.72,28.26 33.91,27.88 v33.78,27.81
  Bottom 0.203: J2.16 38.1,30.48 36.07,30.48 33.85,28.26 | 33.85,28.26 33.78,28.19 v33.78,27.81 | 33.85,28.26 33.65,27.88 v33.78,27.81 | 33.85,28.26 33.93,27.84 v33.78,27.81
LED8  (via drill 0.3 pad 0.03)
  Top 0.203: M1.11 35.72,28.25 | 35.72,28.25 35.72,27.91 v35.81,27.81 | 35.72,28.25 35.67,27.83 v35.81,27.81 | 35.72,28.25 35.94,27.89 v35.81,27.81
  Bottom 0.203: 36.26,27.81 37.97,27.81 J2.17 | 36.26,27.81 v35.81,27.81 | 36.26,27.81 35.86,27.95 v35.81,27.81 | 36.26,27.81 35.86,27.67 v35.81,27.81
N$1
  Top 0.203: D2.2 2.67,29.46 3.81,28.32 3.81,26.29 R5.1
P0_RX+
  Top 0.254: M1.41 39.57,4.01 J3.15
P0_RX-
  Top 0.254: M1.42 41.72,3.62 J3.16
P0_TX+
  Top 0.254: M1.43 43.72,3.08 J3.17
P0_TX-
  Top 0.254: M1.44 45.72,2.54 J3.18
P4_RX+
  Top 0.254: M1.36 29.41,4.01 28.07,2.67 25.53,2.67 J3.10
P4_RX-
  Top 0.254: M1.37 31.44,4.01 30.1,2.67 28.7,2.67 27.3,1.27 J3.11
P4_TX+
  Top 0.254: M1.38 33.35,4.01 32,2.67 30.73,2.67 29.34,1.27 J3.12
P4_TX-
  Top 0.254: M1.39 35.38,4.01 34.04,2.67 33.15,2.67 J3.13
SPDIF_OUT  (via drill 0.3 pad 0.03)
  Top 0.203: M1.29 17.22,8.31 18.61,6.92 | 18.61,6.92 18.67,6.86 v18.67,6.48 | 18.61,6.92 18.52,6.5 v18.67,6.48 | 18.61,6.92 18.8,6.54 v18.67,6.48
  Bottom 0.203: 18.54,6.04 18.54,6.35 v18.67,6.48 | 18.54,6.04 18.54,5.84 16.76,4.06 14.61,4.06 14.22,3.68 12.32,3.68 11.94,3.3 9.91,3.3 9.53,2.92 7.49,2.92 7.11,2.54 5.08,2.54 J3.2 | 18.54,6.04 18.79,6.39 v18.67,6.48 | 18.54,6.04 18.52,6.47 v18.67,6.48
SPI_CLK
  Top 0.203: M1.46 49.72,2.48 49.53,2.29 J3.20
SPI_CS
  Top 0.203: M1.48 53.72,3.18 54.61,2.29 J3.22
SPI_MISO
  Top 0.203: M1.49 55.72,3.84 57.15,2.41 J3.23
SPI_MOSI
  Top 0.203: M1.47 51.72,2.76 52.07,2.41 J3.21
UART_CTS  (via drill 0.3 pad 0.03)
  Top 0.203: v56.77,18.54 57.22,18.54 | 57.22,18.54 58.19,18.54 M1.56 | 57.22,18.54 56.82,18.68 v56.77,18.54 | 57.22,18.54 56.82,18.4 v56.77,18.54
  Bottom 0.203: v56.77,18.54 56.45,18.86 | 56.45,18.86 56.01,19.3 22.61,19.3 21.21,20.7 21.21,25.65 17.02,29.84 9.27,29.84 8.89,30.23 J2.4 | 56.45,18.86 56.63,18.48 v56.77,18.54 | 56.45,18.86 56.83,18.68 v56.77,18.54
UART_RTS  (via drill 0.3, 0.3 pad 0.03)
  Top 0.203: M1.55 57.22,16.51 | 57.22,16.51 v56.77,16.51 | v19.05,27.05 18.8,27.3 18.8,27.42 | 18.8,27.42 18.8,28.38 | 18.8,28.38 v18.8,28.83 | C11.1 R9.2 3.94,25.65 | 3.94,25.65 6.99,25.65 11.43,30.1 J2.5 | 3.94,25.65 3.56,25.65 2.41,27.05 2.41,27.43 SW2.2 | 57.22,16.51 56.82,16.65 v56.77,16.51 | 57.22,16.51 56.82,16.37 v56.77,16.51 | 18.8,27.42 18.91,27.01 v19.05,27.05 | 18.8,27.42 19.14,27.17 v19.05,27.05 | 18.8,28.38 18.94,28.78 v18.8,28.83 | 18.8,28.38 18.66,28.78 v18.8,28.83
  Bottom 0.203: v56.77,16.51 56.45,16.83 | 56.45,16.83 54.36,18.92 22.48,18.92 20.83,20.57 20.83,25.53 19.47,26.89 | 19.47,26.89 19.3,27.05 v19.05,27.05 | v18.8,28.83 18.54,28.83 18.38,28.99 | 18.38,28.99 17.14,30.23 13.72,30.23 12.19,31.75 J2.5 | 56.45,16.83 56.63,16.45 v56.77,16.51 | 56.45,16.83 56.83,16.64 v56.77,16.51 | 19.47,26.89 19.15,27.16 v19.05,27.05 | 19.47,26.89 19.04,26.9 v19.05,27.05 | 18.38,28.99 18.7,28.72 v18.8,28.83 | 18.38,28.99 18.8,28.98 v18.8,28.83
UART_RX  (via drill 0.3 pad 0.03)
  Top 0.203: M1.20 17.25,26.54 18.09,26.54 | 18.09,26.54 v18.54,26.54 | 18.09,26.54 18.49,26.4 v18.54,26.54 | 18.09,26.54 18.49,26.68 v18.54,26.54
  Bottom 0.203: J2.3 6.86,31.75 9.14,29.46 16.89,29.46 18.41,27.94 18.41,26.98 | v18.54,26.54 arc-90 18.41,26.67 18.41,26.98 | 18.41,26.98 18.39,26.55 v18.54,26.54 | 18.41,26.98 18.66,26.63 v18.54,26.54
UART_TX  (via drill 0.3 pad 0.03)
  Top 0.203: M1.21 17.27,24.51 18.22,25.46 | 18.22,25.46 v18.54,25.78 | 18.22,25.46 18.61,25.65 v18.54,25.78 | 18.22,25.46 18.41,25.84 v18.54,25.78
  Bottom 0.203: J2.2 4.57,31.75 5.84,30.48 7.62,30.48 9.02,29.08 16.76,29.08 18.03,27.81 18.03,26.29 18.22,26.1 | v18.54,25.78 18.22,26.1 | 18.22,26.1 18.41,25.72 v18.54,25.78 | 18.22,26.1 18.61,25.91 v18.54,25.78
USB_N
  Top 0.368: 65.77,2.29 65.78,2.29 | 65.78,2.29 65.78,3.19 64.38,4.59 64.38,6.12 59.28,11.22 58.95,11.22 58.24,10.51 | J3.26 65.78,2.28 65.78,2.29
  Top 0.381: M1.52 58.24,10.51
USB_P
  Top 0.368: J3.27 66.3,2.28 66.3,3.41 64.9,4.81 64.9,6.33 59.47,11.77 58.96,11.77 M1.53
XLNA  (via drill 0.3 pad 0.03)
  Top 0.203: M1.5 47.72,28.26 | 47.72,28.26 47.72,27.85 v47.75,27.81 | 47.72,28.26 47.61,27.85 v47.75,27.81 | 47.72,28.26 47.89,27.87 v47.75,27.81
  Bottom 0.203: v47.75,27.81 48.07,28.13 | 48.07,28.13 48.9,28.96 51.18,28.96 51.94,29.72 53.85,29.72 54.23,30.1 56.13,30.1 56.52,30.48 66.04,30.48 J2.27 | 48.07,28.13 47.69,27.95 v47.75,27.81 | 48.07,28.13 47.89,27.75 v47.75,27.81

### Text on the board
tPlace: Rev.
bPlace: RX | +5V | TX | CTS | RTS | GND | +3V3 | +3V3 | LED0 | LED1 | LED2 | LED3 | LED4 | LED5 | LED6 | LED7 | LED8 | GND | +3V3 | TDO | TDI | TCK | TMS | !RESET_L | GPIO24 | FLASH_WP | XLNA | GND | UART | LED | JTAG | Rev. | c 2014-2015, Domino Team / All rights reserved. | Licensed under a Creative Commons / Attribution-Share-Alike Unported License. / See creativecommons.org/licenses/by-sa/4.0/ | I2S | ETH_P4 | ETH_P0 | SPI | USB | SPDIF_OUT | MCK | D- | GND | MICIN | SD | WS | CK | +3V3 | GND | RX+ | RX- | TX+ | TX- | +2VA_ETH_OUT | RX+ | RX- | TX+ | TX- | +3V3 | CLK | MOSI | CS | MISO | GND | +5V | D+ | GND
Document: DRILL CHART: TOP TO BOTTOM | LINE WIDTH IMPEDANCE CHART FOR REFERENCE | Class | RF | Type | Coated Coplanar Waveguide With Ground 1B | Layer | Impedance | Trace Width | Trace Separation | Ground Separation | TOP, / BOTTOM | 50 Ohms | 26 mils | N/A | 6 mils | Class | USB | Type | Diff Coated Coplanar Waveguide With Ground 1B | Layer | Impedance | Trace Width | Trace Separation | Ground Separation | TOP, / BOTTOM | 90 Ohms | 14.5 mils | 6 mils | 6 mils | Class | Ethernet | Type | Diff Coated Coplanar Waveguide With Ground 1B | Layer | Impedance | Trace Width | Trace Separation | Ground Separation | TOP, / BOTTOM | 100 Ohms | 10 mils | 6 mils | 6 mils | STACK-UP FOR REFERENCE | LAYER 1 L1 TOP | 18 UM CU + 12.5 UM PLATING (30.5 UM) | 1.061 MM+/-10% | CORE | 1.0 MM CORE FR-4 LG 135 / INCLUDING COPPER | LAYER 4 L16 BOTTOM | 18 UM CU + 12.5 UM PLATING (30.5 UM) | NOTES: | 1. PRINTED CIRCUIT BOARD MADE FROM NEMA GRADE FR-4 TG 135 EPOXY / LAMINATE WITH 18 UM COPPER PLATING AND 1 MM THICKNESS. | 2. ALL DIMENSIONS ARE GIVEN IN MILLIMETERS EXCEPT TRACE WIDTH/SPACE. | 3. CIRCUIT PATHS ARE FOR REFERENCE ONLY. | 4. HOLE SIZES SHOWN ARE FINISHED DIAMETERS AFTER PLATING. | 5. BOARD PLATED USING REFLOW OR SIMILAR METHOD. | 6. BOARD TO HAVE WHITE SOLDER MASK ON PLATED SURFACES USING WET / FILM SR100 OR SR1010 EPOXY. / EQUIVALENT WET OR DRY FILM MAY BE USED. | 7. SILKSCREEN BOARD USING BLACK INK. DISTORTION OF SILKSCREEN / IS ACCEPTABLE OVER TRACES. EPOXY INK ON PLATED LANDS IS NOT / ACCEPTABLE | 8. THE FOLLOWING INFORMATION APPLIES TO THIS BOARD: | * 2 COPPER LAYERS | * 1 MM BOARD THICKNESS | * REQUIRES TOP AND BOTTOM SIDE SILKSCREENS | © 2014-2015, The Domino Team. / All rights reserved. | Licensed under a Creative Commons / Attribution-Share-Alike Unported License. / See creativecommons.org/licenses/by-sa/4.0/ | Reference designs are provided "AS IS" and "WITH ALL FAULTS". / The Domino Team disclaims all other warranties express or implied, / regarding this product, including but not limited to, any implied warranties of / merchantibility or fitness for any particular application. | The Domino Team may make changes to specifications and product descriptions / at any time, without notice. | Rev.
DrillLegend: LAYER-STACK
DrillLegend_01-16: 01-16
DrillLegend_01-20: 01-20
Pinout: UART | LED | JTAG | +5V | UART_TX | UART_RX | UART_CTS | UART_RTS | GND | +3v3 | +3v3 | LED0 | LED1 | LED2 | LED3 | LED4 | LED5 | LED6 | LED7 | LED8 | GND | +2V5 | JTAG_TDO | JTAG_TDI | JTAG_TCK | JTAG_TMS | !RESET_L | GPIO24 | FLASH_WP | XLNA | GND | GND | SPDIF_OUT | I2S_MICIN | I2S_MCK | I2S_SD | I2S_WS | I2S_CK | +3V3 | GND | P4_RX+ | P4_RX- | P4_TX+ | P4_TX- | +2VA_ETH_OUT | P0_RX+ | P0_RX- | P0_TX+ | P0_TX- | +3V3 | SPI_CLK | SPI_MOSI | SPI_CS | SPI_MISO | GND | +5V | USB- | USB+ | GND | I2S | ETH4 | ETH0 | SPI | USB | Pinout (.PIN)
Component_side: Component Side (.CMP)
Solder_side: Solder side (.SOL)
Silk_screen_CMP: Silk screen CMP (.PLC)
Silk_screen_SOL: Silk screen SOL (.PLS)
Solder_stop_mask_CMP: Solder stop mask CMP (.STC)
Solder_stop_mask_SOL: Solder stop mask SOL (.STS)
Cream_frame_CMP: Cream frame CMP (.CRC)
Cream_frame_SOL: Cream frame SOL (.CRS)
Drill_data: Drill data (.DRD)
Component_Assembly_CMP: Component Assembly CMP (.ASC)
Component_Assembly_SOL: Component Assembly SOL (.ASS)
Outline: Outline (.OLN)